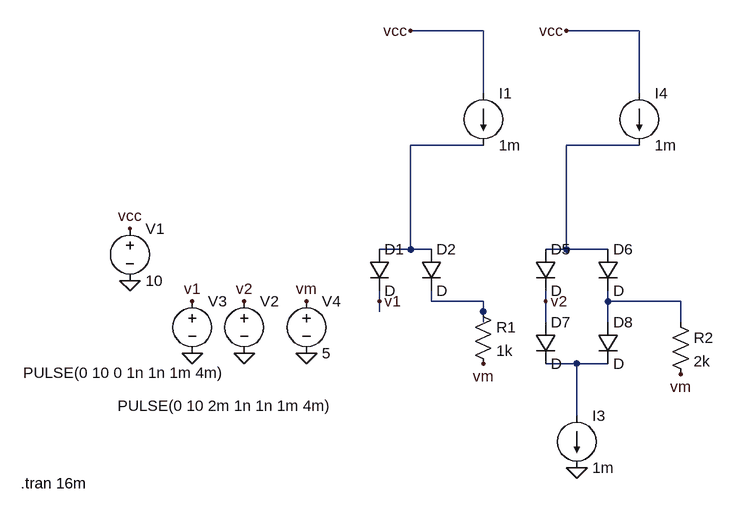
[diagram p0: schematic current.asc]
current.asc, the LTspice schematic file:
Version 4
SHEET 1 880 680
WIRE 288 -256 176 -256
WIRE 528 -256 416 -256
WIRE 288 -160 288 -256
WIRE 528 -160 528 -256
WIRE 288 -80 176 -80
WIRE 528 -80 416 -80
WIRE 176 80 176 -80
WIRE 176 80 128 80
WIRE 208 80 176 80
WIRE 416 80 416 -80
WIRE 416 80 384 80
WIRE 480 80 416 80
WIRE 128 160 128 144
WIRE 208 160 208 144
WIRE 288 160 208 160
WIRE 384 160 384 144
WIRE 480 160 480 144
WIRE 592 160 480 160
WIRE 128 176 128 160
WIRE 288 176 288 160
WIRE 288 192 288 176
WIRE 384 192 384 160
WIRE 480 192 480 160
WIRE 592 192 592 160
WIRE 432 256 384 256
WIRE 480 256 432 256
WIRE 432 336 432 256
FLAG -256 128 0
FLAG -256 48 vcc
FLAG 176 -256 vcc
FLAG -80 240 0
FLAG -160 240 0
FLAG -160 160 v1
FLAG 128 160 v1
FLAG -80 160 v2
FLAG 384 160 v2
FLAG 432 416 0
FLAG 416 -256 vcc
FLAG 16 240 0
FLAG 16 160 vm
FLAG 288 256 vm
FLAG 592 272 vm
SYMBOL diode 112 80 R0
SYMATTR InstName D1
SYMBOL diode 192 80 R0
SYMATTR InstName D2
SYMBOL voltage -256 32 R0
WINDOW 123 0 0 Left 2
WINDOW 39 0 0 Left 2
SYMATTR InstName V1
SYMATTR Value 10
SYMBOL diode 368 80 R0
SYMATTR InstName D5
SYMBOL diode 464 80 R0
SYMATTR InstName D6
SYMBOL diode 368 192 R0
SYMATTR InstName D7
SYMBOL diode 464 192 R0
SYMATTR InstName D8
SYMBOL current 288 -160 R0
WINDOW 123 0 0 Left 2
WINDOW 39 0 0 Left 2
SYMATTR InstName I1
SYMATTR Value 1m
SYMBOL voltage -80 144 R0
WINDOW 3 -195 177 Left 2
WINDOW 123 0 0 Left 2
WINDOW 39 0 0 Left 2
SYMATTR Value PULSE(0 10 2m 1n 1n 1m 4m)
SYMATTR InstName V2
SYMBOL voltage -160 144 R0
WINDOW 3 -260 126 Left 2
WINDOW 123 0 0 Left 2
WINDOW 39 0 0 Left 2
SYMATTR Value PULSE(0 10 0 1n 1n 1m 4m)
SYMATTR InstName V3
SYMBOL res 272 160 R0
SYMATTR InstName R1
SYMATTR Value 1k
SYMBOL res 576 176 R0
SYMATTR InstName R2
SYMATTR Value 2k
SYMBOL current 432 336 R0
WINDOW 123 0 0 Left 2
WINDOW 39 0 0 Left 2
SYMATTR InstName I3
SYMATTR Value 1m
SYMBOL current 528 -160 R0
WINDOW 123 0 0 Left 2
WINDOW 39 0 0 Left 2
SYMATTR InstName I4
SYMATTR Value 1m
SYMBOL voltage 16 144 R0
WINDOW 123 0 0 Left 2
WINDOW 39 0 0 Left 2
SYMATTR InstName V4
SYMATTR Value 5
TEXT -424 440 Left 2 !.tran 16m

The netlist it stands for:
* current.asc
D1 N001 v1 D
D2 N001 N003 D
V1 vcc 0 10
D5 N002 v2 D
D6 N002 N004 D
D7 v2 N005 D
D8 N004 N005 D
I1 vcc N001 1m
V2 v2 0 PULSE(0 10 2m 1n 1n 1m 4m)
V3 v1 0 PULSE(0 10 0 1n 1n 1m 4m)
R1 N003 vm 1k
R2 N004 vm 2k
I3 N005 0 1m
I4 vcc N002 1m
V4 vm 0 5
.model D D
.lib standard.dio
.tran 16m
.backanno
.end